# Altium schematic sheet TM_FM_BLEV10.SchDoc
size A3
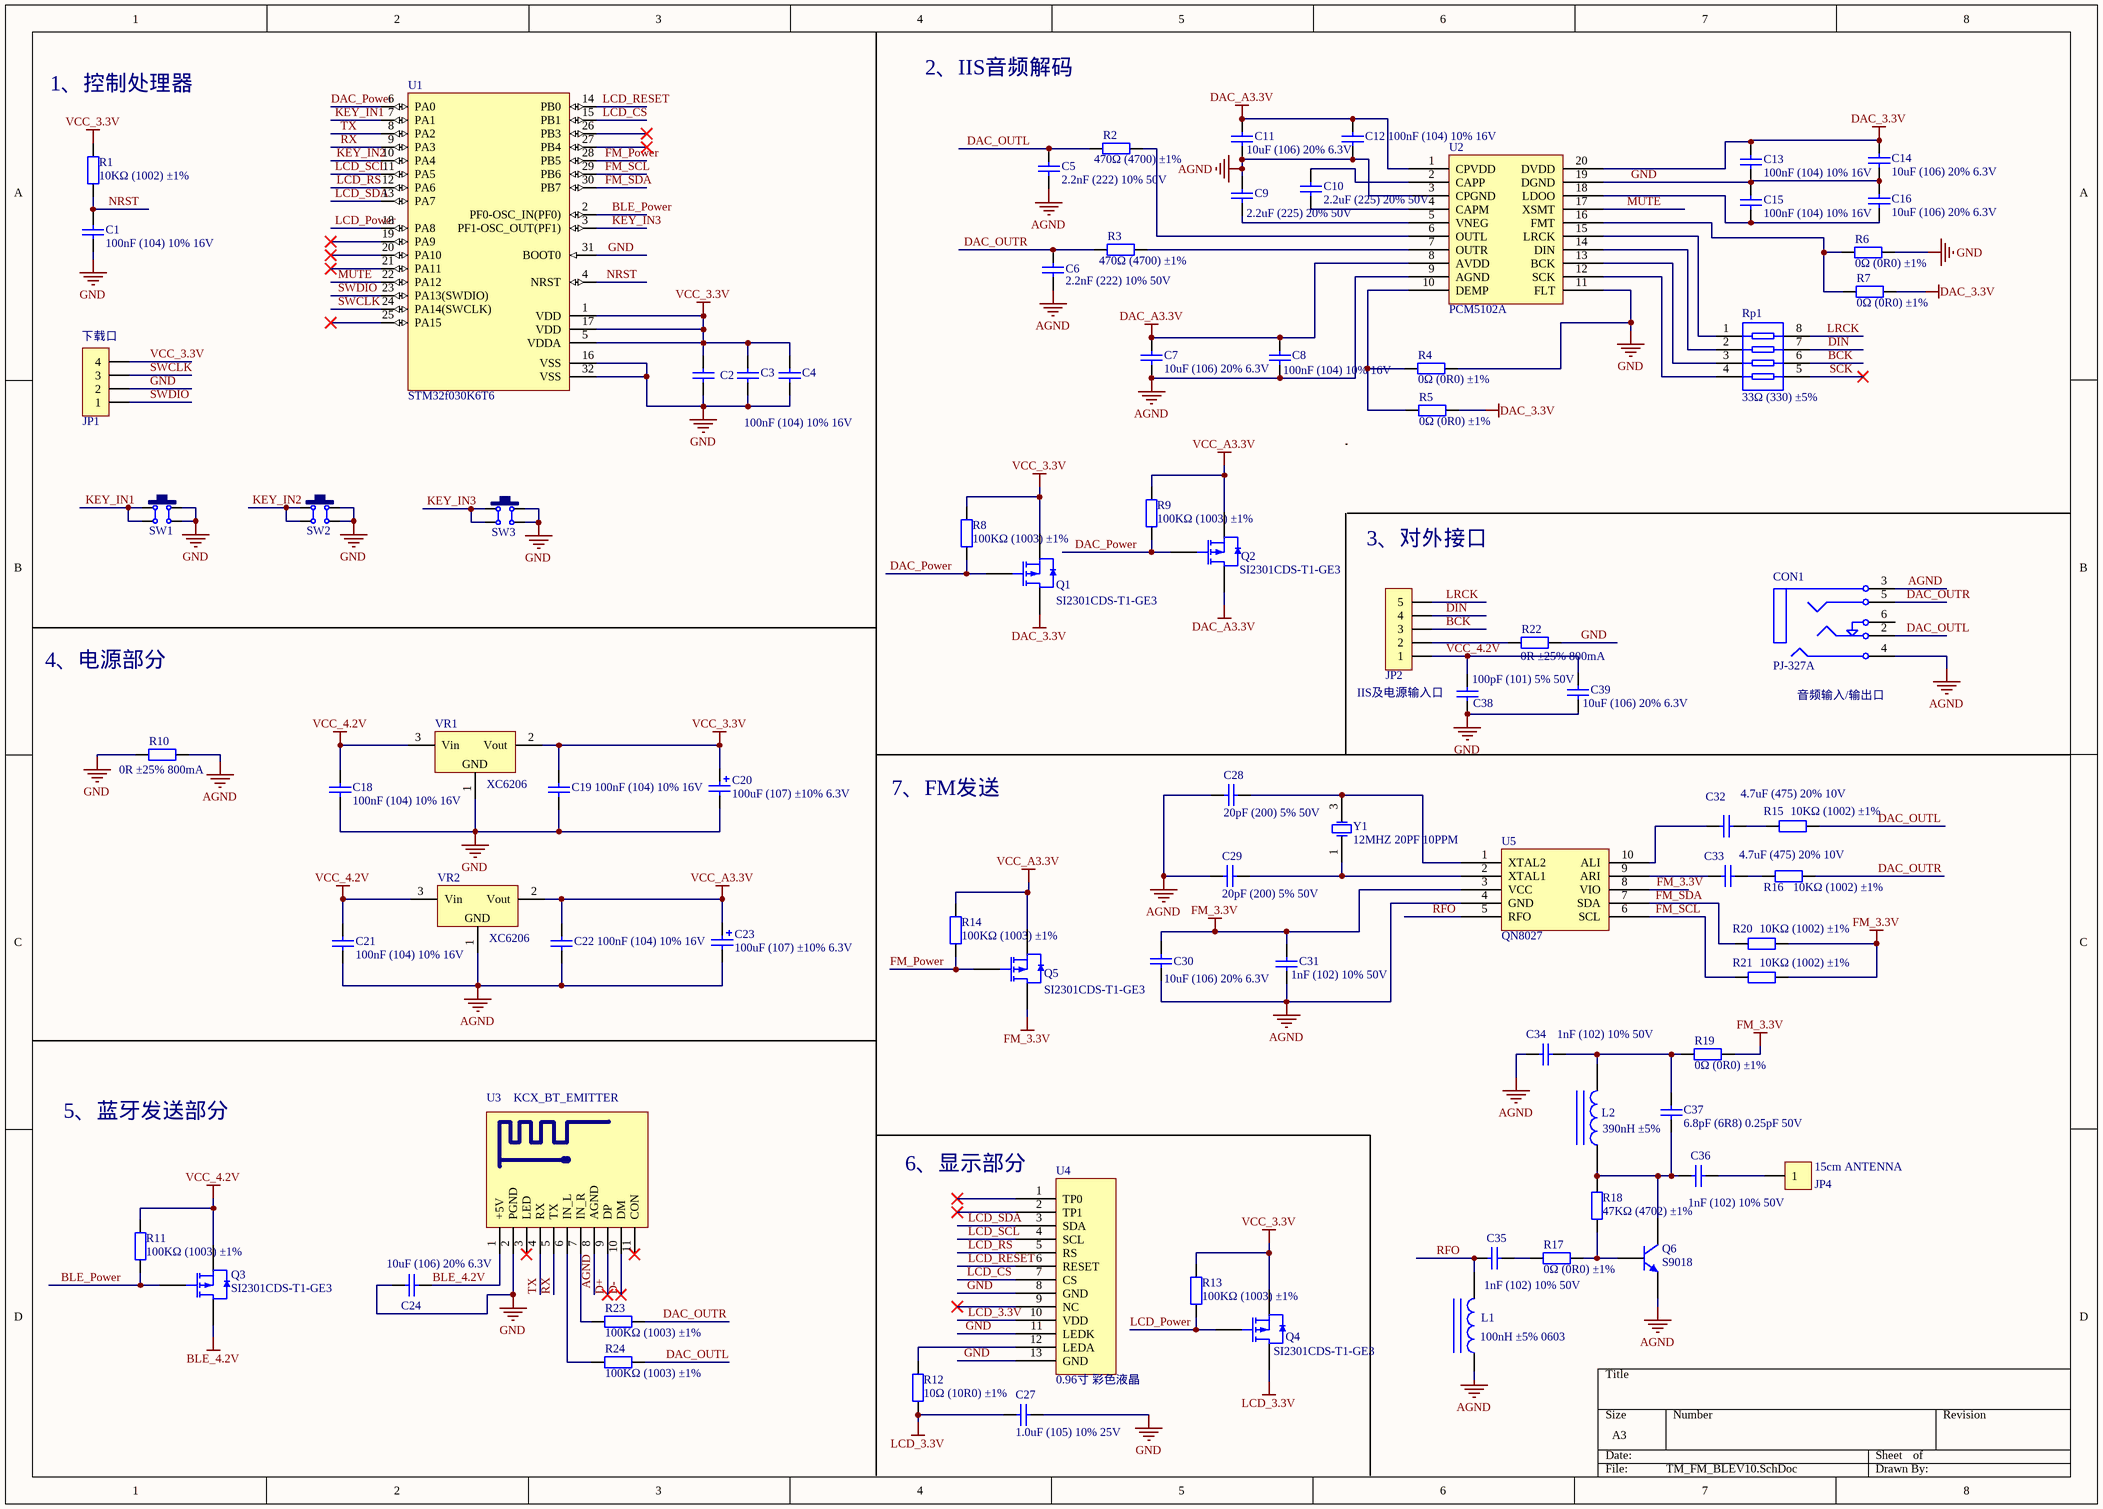
[diagram p0: TM_FM_BLEV10.SchDoc]

## Parts
C1  100nF (104) 10% 16V  [0402_C]
C2  100nF (104) 10% 16V  [0402_C]
C3  100nF (104) 10% 16V  [0402_C]  (value not drawn)
C4  100nF (104) 10% 16V  [0402_C]  (value not drawn)
C5  2.2nF (222) 10% 50V  [0402_C]
C6  2.2nF (222) 10% 50V  [0402_C]
C7  10uF (106) 20% 6.3V  [0402_C]
C8  100nF (104) 10% 16V  [0402_C]
C9  2.2uF (225) 20% 50V  [0402_C]
C10  2.2uF (225) 20% 50V  [0402_C]
C11  10uF (106) 20% 6.3V  [0402_C]
C12  100nF (104) 10% 16V  [0402_C]
C13  100nF (104) 10% 16V  [0402_C]
C14  10uF (106) 20% 6.3V  [0402_C]
C15  100nF (104) 10% 16V  [0402_C]
C16  10uF (106) 20% 6.3V  [0402_C]
C18  100nF (104) 10% 16V  [0402_C]
C19  100nF (104) 10% 16V  [0402_C]
C20  100uF (107) ±10% 6.3V  [CASE-B_3528]
C21  100nF (104) 10% 16V  [0402_C]
C22  100nF (104) 10% 16V  [0402_C]
C23  100uF (107) ±10% 6.3V  [CASE-B_3528]
C24  10uF (106) 20% 6.3V  [0402_C]
C27  1.0uF (105) 10% 25V  [0402_C]
C28  20pF (200) 5% 50V  [0402_C]
C29  20pF (200) 5% 50V  [0402_C]
C30  10uF (106) 20% 6.3V  [0402_C]
C31  1nF (102) 10% 50V  [0402_C]
C32  4.7uF (475) 20% 10V  [0402_C]
C33  4.7uF (475) 20% 10V  [0402_C]
C34  1nF (102) 10% 50V  [0603_C]
C35  1nF (102) 10% 50V  [0603_C]
C36  1nF (102) 10% 50V  [0603_C]
C37  6.8pF (6R8) 0.25pF 50V  [0603_C]
C38  100pF (101) 5% 50V  [0402_C]
C39  10uF (106) 20% 6.3V  [0402_C]
CON1  PJ-327A  [PJ327A-无固定孔]
JP1  HDR-1X4  [简易下载点]  (value not drawn)
JP2  HDR-1X5  [焊接点]  (value not drawn)
JP4  HDR-1X1  [单个焊接点]  (value not drawn)
L1  100nH ±5% 0603  [0603_L]
L2  390nH ±5%  [0603_L]
Q1  SI2301CDS-T1-GE3  [SOT-23(SOT-23-3)]
Q2  SI2301CDS-T1-GE3  [SOT-23(SOT-23-3)]
Q3  SI2301CDS-T1-GE3  [SOT-23(SOT-23-3)]
Q4  SI2301CDS-T1-GE3  [SOT-23(SOT-23-3)]
Q5  SI2301CDS-T1-GE3  [SOT-23(SOT-23-3)]
Q6  S9018  [SOT-23(SOT-23-3)]
R1  10KΩ (1002) ±1%  [0402_R]
R2  470Ω (4700) ±1%  [0402_R]
R3  470Ω (4700) ±1%  [0402_R]
R4  0Ω (0R0) ±1%  [0402_R]
R5  0Ω (0R0) ±1%  [0402_R]
R6  0Ω (0R0) ±1%  [0402_R]
R7  0Ω (0R0) ±1%  [0402_R]
R8  100KΩ (1003) ±1%  [0402_R]
R9  100KΩ (1003) ±1%  [0402_R]
R10  0R ±25% 800mA  [0603_R]
R11  100KΩ (1003) ±1%  [0402_R]
R12  10Ω (10R0) ±1%  [0402_R]
R13  100KΩ (1003) ±1%  [0402_R]
R14  100KΩ (1003) ±1%  [0402_R]
R15  10KΩ (1002) ±1%  [0402_R]
R16  10KΩ (1002) ±1%  [0402_R]
R17  0Ω (0R0) ±1%  [0402_R]
R18  47KΩ (4702) ±1%  [0402_R]
R19  0Ω (0R0) ±1%  [0402_R]
R20  10KΩ (1002) ±1%  [0402_R]
R21  10KΩ (1002) ±1%  [0402_R]
R22  0R ±25% 800mA  [0603_R]
R23  100KΩ (1003) ±1%  [0402_R]
R24  100KΩ (1003) ±1%  [0402_R]
Rp1  33Ω (330) ±5%  [0402_Rx4]
SW1  6x6x5  [TSW SMD-6*6*4.3]  (value not drawn)
SW2  6x6x5  [TSW SMD-6*6*4.3]  (value not drawn)
SW3  6x6x5  [TSW SMD-6*6*4.3]  (value not drawn)
U1  STM32f030K6T6  [LQFP32 7X7_M]
U2  PCM5102A  [TSSOP20_N]
U3  KCX_BT_EMITTER  [蓝牙音频发送模组]
U4  0.96寸 彩色液晶  [0.96寸 彩色液晶]
U5  QN8027  [MSOP10_N]
VR1  XC6206  [SOT23-3M]
VR2  XC6206  [SOT23-3M]
Y1  12MHZ 20PF 10PPM  [SMD-3225_4P]

## Nets
AGND: C5.2 C6.2 C7.1 C8.1 C9.2 C11.1 C12.1 C21.2 C22.1 C23.2 C28.1 C29.1 C30.1 C31.1 C34.1 CON1.3 CON1.4 L1.1 Q6.2(E) R10.2 U2.3(CPGND) U2.9(AGND) U3.8(AGND) U5.4(GND) VR2.1(GND)
BLE_4.2V: C24.1 Q3.3(D) U3.1(+5V)
DAC_3.3V: C13.2 C14.2 Q1.3(D) R5.2 R7.2 U2.20(DVDD)
DAC_A3.3V: C7.2 C8.2 C11.2 C12.2 Q2.3(D) U2.1(CPVDD) U2.8(AVDD)
FM_3.3V: C30.2 C31.2 Q5.3(D) R19.2 R20.1 R21.1 U5.3(VCC) U5.8(VIO)
GND: C1.1 C2.1 C3.1 C4.1 C13.1 C14.1 C15.2 C16.2 C18.2 C19.1 C20.2 C24.2 C27.1 C38.1 C39.1 JP1.2 R4.2 R6.2 R10.1 R22.2 SW1.2 SW1.3 SW2.2 SW2.3 SW3.2 SW3.3 U1.16(VSS) U1.31(BOOT0) U1.32(VSS) U2.11(FLT) U2.19(DGND) U3.2(PGND) U4.8(GND) U4.11(LEDK) U4.13(GND) VR1.1(GND)
LCD_3.3V: C27.2 Q4.3(D) R12.1 U4.10(VDD)
VCC_3.3V: C2.2 C3.2 C4.2 C19.2 C20.1 JP1.4 Q1.2(S) Q4.2(S) R1.2 R8.2 R13.2 U1.1(VDD) U1.5(VDDA) U1.17(VDD) VR1.2(Vout)
VCC_4.2V: C18.1 C21.1 C38.2 C39.2 JP2.1 Q3.2(S) R11.2 VR1.3(Vin) VR2.3(Vin)
VCC_A3.3V: C22.2 C23.1 Q2.2(S) Q5.2(S) R9.2 R14.2 VR2.2(Vout)
BCK: JP2.3 Rp1.6
BLE_Power: Q3.1(G) R11.1 U1.2(PF0-OSC_IN(PF0))
D+: U3.9(DP)
D-: U3.10(DM)
DAC_OUTL: C5.1 CON1.2 R2.1 R15.1 R24.1
DAC_OUTR: C6.1 CON1.5 R3.1 R16.1 R23.1
DAC_Power: Q1.1(G) Q2.1(G) R8.1 R9.1 U1.6(PA0)
DIN: JP2.4 Rp1.7
FM_Power: Q5.1(G) R14.1 U1.28(PB5)
FM_SCL: R21.2 U1.29(PB6) U5.6(SCL)
FM_SDA: R20.2 U1.30(PB7) U5.7(SDA)
KEY_IN1: SW1.1 SW1.4 U1.7(PA1)
KEY_IN2: SW2.1 SW2.4 U1.10(PA4)
KEY_IN3: SW3.1 SW3.4 U1.3(PF1-OSC_OUT(PF1))
LCD_CS: U1.15(PB1) U4.7(CS)
LCD_Power: Q4.1(G) R13.1 U1.18(PA8)
LCD_RESET: U1.14(PB0) U4.6(RESET)
LCD_RS: U1.12(PA6) U4.5(RS)
LCD_SCL: U1.11(PA5) U4.4(SCL)
LCD_SDA: U1.13(PA7) U4.3(SDA)
LRCK: JP2.5 Rp1.8
MUTE: U1.22(PA12) U2.17(XSMT)
NRST: C1.2 R1.1 U1.4(NRST)
RFO: C35.1 L1.2 U5.5(RFO)
RX: U1.9(PA3) U3.5(TX)
SCK: Rp1.5
SWCLK: JP1.3 U1.24(PA14(SWCLK))
SWDIO: JP1.1 U1.23(PA13(SWDIO))
TX: U1.8(PA2) U3.4(RX)
NetC9_1: C9.1 U2.5(VNEG)
NetC10_1: C10.1 U2.4(CAPM)
NetC10_2: C10.2 U2.2(CAPP)
NetC15_1: C15.1 C16.1 U2.18(LDOO)
NetC28_2: C28.2 U5.1(XTAL2) Y1.3(OSC2)
NetC29_2: C29.2 U5.2(XTAL1) Y1.1(OSC1)
NetC32_1: C32.1 U5.10(ALI)
NetC32_2: C32.2 R15.2
NetC33_1: C33.1 U5.9(ARI)
NetC33_2: C33.2 R16.2
NetC34_2: C34.2 C37.2 L2.2 R19.1
NetC35_2: C35.2 R17.1
NetC36_1: C36.1 C37.1 L2.1 Q6.3(C) R18.2
NetC36_2: C36.2 JP4.1
NetJP2_2: JP2.2 R22.1
NetQ6_1: Q6.1(B) R17.2 R18.1
NetR2_2: R2.2 U2.6(OUTL)
NetR3_2: R3.2 U2.7(OUTR)
NetR4_1: R4.1 R5.1 U2.10(DEMP)
NetR6_1: R6.1 R7.1 U2.16(FMT)
NetR12_2: R12.2 U4.12(LEDA)
NetR23_2: R23.2 U3.7(IN_R)
NetR24_2: R24.2 U3.6(IN_L)
NetRp1_1: Rp1.1 U2.15(LRCK)
NetRp1_2: Rp1.2 U2.14(DIN)
NetRp1_3: Rp1.3 U2.13(BCK)
NetRp1_4: Rp1.4 U2.12(SCK)

Not connected (* = marked no-connect by the designer): CON1 6; U1 19(PA9)* 20(PA10)* 21(PA11)* 25(PA15)* 26(PB3)* 27(PB4)*; U3 3(LED)* 11(CON)*; U4 1(TP0)* 2(TP1)* 9(NC)*

## Notes on the sheet
- 1、控制处理器
- 2、IIS音频解码
- (near JP1) 下载口
- (near JP2) 3、对外接口
- 4、电源部分
- (near JP2) IIS及电源输入口
- (near CON1) 音频输入/输出口
- 7、FM发送
- 5、蓝牙发送部分
- 6、显示部分
- (near JP4) 15cm ANTENNA

## Library data of the parts
C1-C4 C8 C12 C13 C15 C18 C19 C21 C22 = 0402 100nF (104) 10% 16V: 贴片电容; ComponentLink1Description: 供应商链接; ComponentLink1URL: http://www.szlcsc.com/product/details_1877.html; Package: 0402; Supplier: LC; SuppliersPartNumber: C1525
C5 C6 C9 C10 = 0402 2.2nF (222) 10% 50V: 贴片电容; ComponentLink1Description: 供应商链接; ComponentLink1URL: http://www.szlcsc.com/product/details_1883.html; Package: 0402; Supplier: LC; SuppliersPartNumber: C1531
C7 C11 C14 C16 C24 C30 C39 = 0402 10uF (106) 20% 6.3V: 贴片电容; ComponentLink1Description: 供应商链接; ComponentLink1URL: http://www.szlcsc.com/product/details_16204.html; Package: 0402; Supplier: LC; SuppliersPartNumber: C15525
C20 C23 = 3528 100uF (107) 10% 6.3V: 钽电容; ComponentLink1Description: 供应商链接; ComponentLink1URL: http://www.szlcsc.com/product/details_16815.html; Package: 3528; Supplier: LC; SuppliersPartNumber: C16133
C27 = 0402 1.0uF (105) 10% 25V: 贴片电容; ComponentLink1Description: 供应商链接; ComponentLink1URL: http://www.szlcsc.com/product/details_53938.html; Package: 0402; Supplier: LC; SuppliersPartNumber: C52923
C28 C29 = 0402 20pF (200) 5% 50V: 贴片电容; ComponentLink1Description: 供应商链接; ComponentLink1URL: http://www.szlcsc.com/product/details_1906.html; Package: 0402; Supplier: LC; SuppliersPartNumber: C1554
C31 = 0402 1nF (102) 10% 50V: 贴片电容; ComponentLink1Description: 供应商链接; ComponentLink1URL: http://www.szlcsc.com/product/details_1875.html; Package: 0402; Supplier: LC; SuppliersPartNumber: C1523
C32 C33 = 0402 4.7uF (475) 20% 10V: 贴片电容; ComponentLink1Description: 供应商链接; ComponentLink1URL: http://www.szlcsc.com/product/details_24469.html; Package: 0402; Supplier: LC; SuppliersPartNumber: C23733
C34-C36 = 0603 1nF (102) 10% 50V: 贴片电容; ComponentLink1Description: 供应商链接; ComponentLink1URL: http://www.szlcsc.com/product/details_1940.html; Package: 0603; Supplier: LC; SuppliersPartNumber: C1588
C37 = 0603 6.8pF (6R8) 0.25pF 50V: 贴片电容; ComponentLink1Description: 供应商链接; ComponentLink1URL: http://www.szlcsc.com/product/details_2031.html; Package: 0603; Supplier: LC; SuppliersPartNumber: C1679
C38 = 0402 100pF (101) 5% 50V: 贴片电容; ComponentLink1Description: 供应商链接; ComponentLink1URL: http://www.szlcsc.com/product/details_1898.html; Package: 0402; Supplier: LC; SuppliersPartNumber: C1546
JP1 = Header 4: 4P接插件; 版权归属: 黎明电子style; BOM名称: 4P接插件; 学习资源: https://lmdzstyle.taobao.com/
JP2 = Header 5: 5P接插件; 版权归属: 黎明电子style; BOM名称: 5P接插件; 学习资源: https://lmdzstyle.taobao.com/
JP4 = Header 1: 1P接插件; 版权归属: 黎明电子style; BOM名称: 1P接插件; 学习资源: https://lmdzstyle.taobao.com/
L1 = 0603 68nH 5% 0603: 贴片电感; ComponentLink1Description: 供应商链接; ComponentLink1URL: http://www.szlcsc.com/product/details_14064.html; Package: 0603; Supplier: LC; SuppliersPartNumber: C13415
L2 = 0603 33nH 5%: 贴片电感; ComponentLink1Description: 供应商链接; ComponentLink1URL: http://www.szlcsc.com/product/details_36021.html; Package: 0603; Supplier: LC; SuppliersPartNumber: C35050
Q1-Q5 = SI2301CDS-T1-GE3: MOS(场效应管); ComponentLink1Description: 供应商链接; ComponentLink1URL: http://www.szlcsc.com/product/details_11030.html; Package: SOT-23(SOT-23-3); Supplier: LC; SuppliersPartNumber: C10487
Q6 = SOT-23 2SC3356-T1B-A    S/YS档: 三极管; ComponentLink1Description: 供应商链接; ComponentLink1URL: http://www.szlcsc.com/product/details_10189.html; Package: SOT-23; Supplier: LC; SuppliersPartNumber: C9659
R1 R15 R16 R20 R21 = 0402 10KΩ (1002) 1%: 贴片电阻; ComponentLink1Description: 供应商链接; ComponentLink1URL: http://www.szlcsc.com/product/details_26487.html; Package: 0402; Supplier: LC; SuppliersPartNumber: C25744
R2 R3 = 0402 470Ω (4700) 1%: 贴片电阻; ComponentLink1Description: 供应商链接; ComponentLink1URL: http://www.szlcsc.com/product/details_25860.html; Package: 0402; Supplier: LC; SuppliersPartNumber: C25117
R4-R7 R17 R19 = 0402 0Ω (0R0) 1%: 贴片电阻; ComponentLink1Description: 供应商链接; ComponentLink1URL: http://www.szlcsc.com/product/details_17853.html; Package: 0402; Supplier: LC; SuppliersPartNumber: C17168
R8 R9 R11 R13 R14 R23 R24 = 0402 100KΩ (1003) 1%: 贴片电阻; ComponentLink1Description: 供应商链接; ComponentLink1URL: http://www.szlcsc.com/product/details_26484.html; Package: 0402; Supplier: LC; SuppliersPartNumber: C25741
R10 R22 = 0603 0Ω (0R0) 1%: 贴片电阻; ComponentLink1Description: 供应商链接; ComponentLink1URL: http://www.szlcsc.com/product/details_21903.html; Package: 0603; Supplier: LC; SuppliersPartNumber: C21189
R12 = 0402 10Ω (10R0) 1%: 贴片电阻; ComponentLink1Description: 供应商链接; ComponentLink1URL: http://www.szlcsc.com/product/details_25820.html; Package: 0402; Supplier: LC; SuppliersPartNumber: C25077
R18 = 0402 47KΩ (4702) 1%: 贴片电阻; ComponentLink1Description: 供应商链接; ComponentLink1URL: http://www.szlcsc.com/product/details_26535.html; Package: 0402; Supplier: LC; SuppliersPartNumber: C25792
Rp1 = 0402*4 33Ω (330) 5%: 贴片排阻; ComponentLink1Description: 供应商链接; ComponentLink1URL: http://www.szlcsc.com/product/details_26244.html; Package: 0402*4; Supplier: LC; SuppliersPartNumber: C25501
SW1-SW3 = TSW SMD-6x6: 贴片6x6轻触开关; 版权归属: 黎明电子style; BOM名称: 贴片6x6轻触开关; 学习资源: https://lmdzstyle.taobao.com/
U2 = PCM5102A: 音频解码
Y1 = SMD-3225_4P  12MHZ 20PF 10PPM: 贴片晶振; ComponentLink1Description: 供应商链接; ComponentLink1URL: http://www.szlcsc.com/product/details_9522.html; Package: SMD-3225_4P; Supplier: LC; SuppliersPartNumber: C9002